# Altium schematic sheet MCH_FPGA_Banks_66_68_HP_FMC.SchDoc: Metlino
size 420 x 297 mm; CheckedBy: P.Kulik,T.Przywozki,W.Ruclo; Author: G.Kasprowicz; CompanyName: WUT ISE; DrawnBy: G.Kasprowicz; Organization: WUT ISE; Address1: PW ISE; Address2: Nowowiejska 15/19 00-665 Warsaw; Address3: gkasprow@gmail.com; DocumentNumber: 5; Revision: 2; SheetNumber: 5; SheetTotal: 29; ModifiedBy: -; CheckedDate: -; Title2: FPGA banks - FMC; DivGrp: WUT ISE; Designer: G.Kasprowicz; ModifiedDate: -; ProjectName: Sensor Box
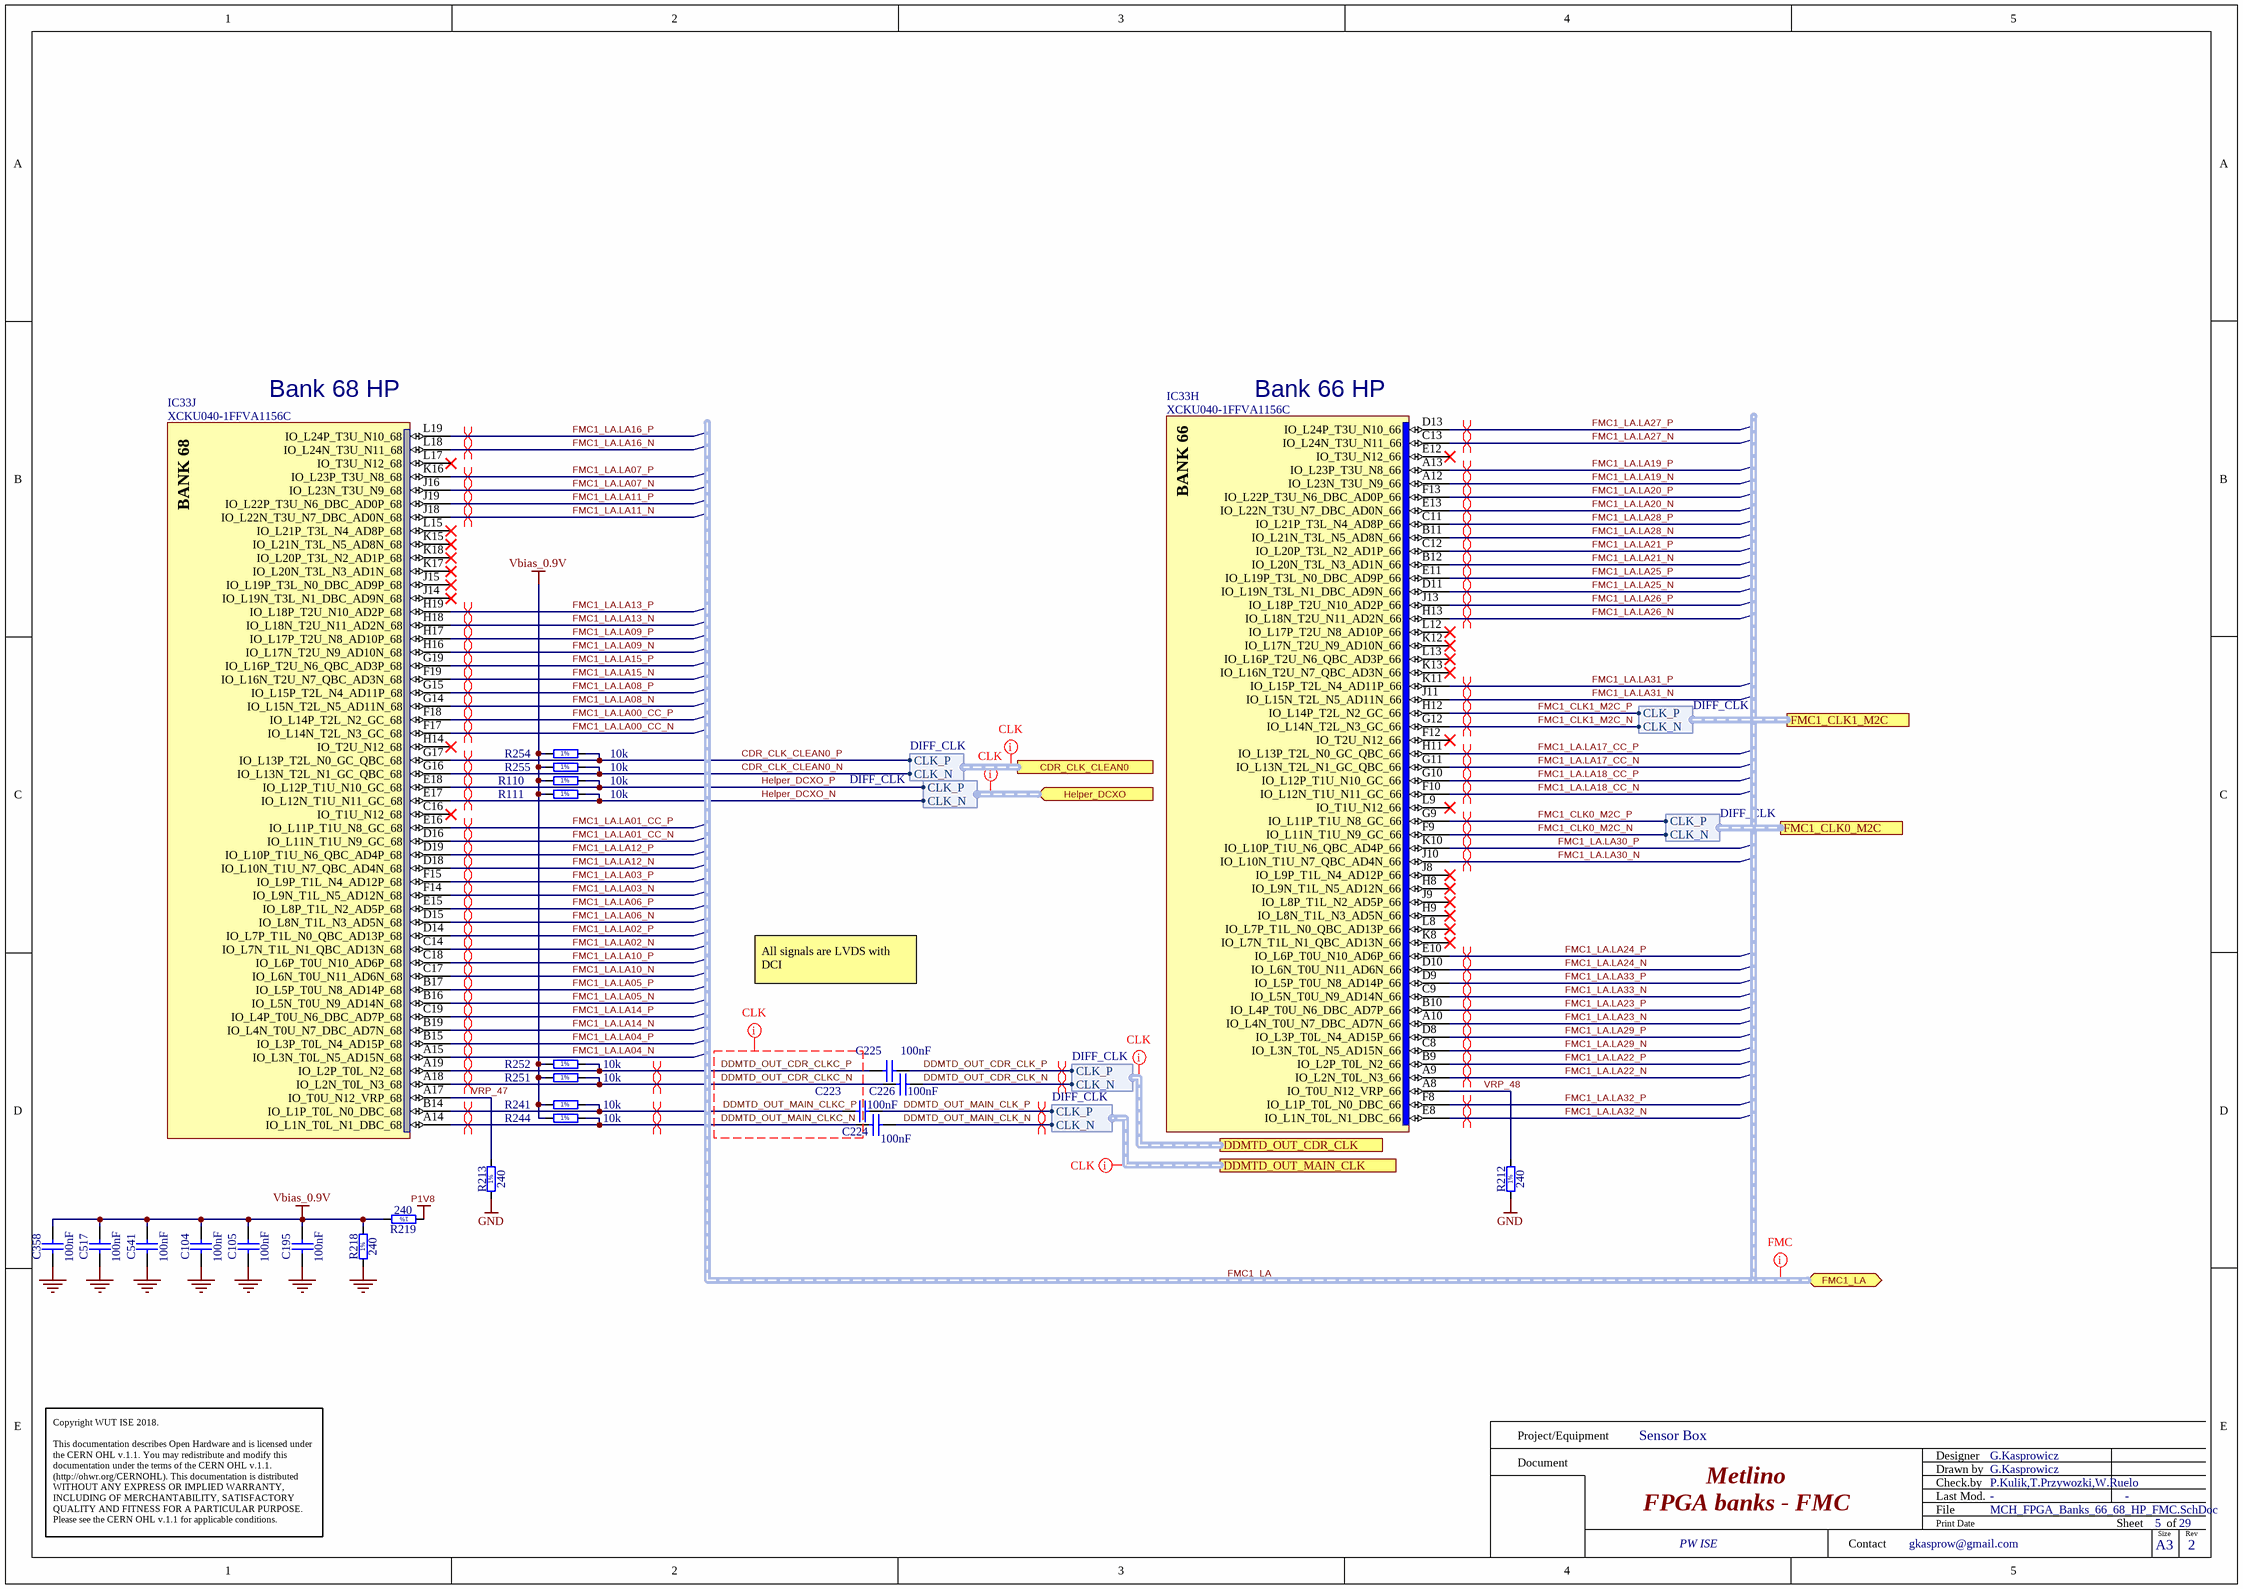
[diagram p0: MCH_FPGA_Banks_66_68_HP_FMC.SchDoc]

## Parts
C104  100nF  [CAPC0603X33N]
C105  100nF  [CAPC0603X33N]
C195  100nF  [CAPC0603X33N]
C223  100nF  [CAPC0603X33N]
C224  100nF  [CAPC0603X33N]
C225  100nF  [CAPC0603X33N]
C226  100nF  [CAPC0603X33N]
C358  100nF  [CAPC0603X33N]
C517  100nF  [CAPC0603X33N]
C541  100nF  [CAPC0603X33N]
IC33  XCKU040-1FFVA1156C  [BGA1156C100P34X34_3500X3500X350]  (parts H,J of 22)
R110  10k  [RESC1005X40N]
R111  10k  [RESC1005X40N]
R212  240  [RESC1005X40N]
R213  240  [RESC1005X40N]
R218  240  [RESC1005X40N]
R219  240  [RESC1005X40N]
R241  10k  [RESC1005X40N]
R244  10k  [RESC1005X40N]
R251  10k  [RESC1005X40N]
R252  10k  [RESC1005X40N]
R254  10k  [RESC1005X40N]
R255  10k  [RESC1005X40N]

## Ports
CDR_CLK_CLEAN0 (harness DIFF_CLK), DDMTD_OUT_CDR_CLK (harness DIFF_CLK), DDMTD_OUT_MAIN_CLK (harness DIFF_CLK), FMC1_CLK0_M2C (harness DIFF_CLK), FMC1_CLK1_M2C (harness DIFF_CLK), FMC1_LA (bidir, harness FMC_LA), Helper_DCXO (in, harness DIFF_CLK)

## Harnesses
DIFF_CLK: CLK_N, CLK_P

## Nets
GND: C104.2 C105.2 C195.2 C358.2 C517.2 C541.2 R212.1 R213.1 R218.1
P1V8: R219.1
Vbias_0.9V: C104.1 C105.1 C195.1 C358.1 C517.1 C541.1 R110.1 R111.1 R218.2 R219.2 R241.1 R244.1 R251.1 R252.1 R254.1 R255.1
CDR_CLK_CLEAN0_N: IC33.G16(IO_L13N_T2L_N1_GC_QBC_68) R255.2 ; port CDR_CLK_CLEAN0.CLK_N
CDR_CLK_CLEAN0_P: IC33.G17(IO_L13P_T2L_N0_GC_QBC_68) R254.2 ; port CDR_CLK_CLEAN0.CLK_P
DDMTD_OUT_CDR_CLK_N: C226.2 ; port DDMTD_OUT_CDR_CLK.CLK_N
DDMTD_OUT_CDR_CLK_P: C225.2 ; port DDMTD_OUT_CDR_CLK.CLK_P
DDMTD_OUT_CDR_CLKC_N: C226.1 IC33.A18(IO_L2N_T0L_N3_68) R251.2
DDMTD_OUT_CDR_CLKC_P: C225.1 IC33.A19(IO_L2P_T0L_N2_68) R252.2
DDMTD_OUT_MAIN_CLK_N: C224.2 ; port DDMTD_OUT_MAIN_CLK.CLK_N
DDMTD_OUT_MAIN_CLK_P: C223.2 ; port DDMTD_OUT_MAIN_CLK.CLK_P
DDMTD_OUT_MAIN_CLKC_N: C224.1 IC33.A14(IO_L1N_T0L_N1_DBC_68) R244.2
DDMTD_OUT_MAIN_CLKC_P: C223.1 IC33.B14(IO_L1P_T0L_N0_DBC_68) R241.2
FMC1_CLK0_M2C_N: IC33.F9(IO_L11N_T1U_N9_GC_66) ; port FMC1_CLK0_M2C.CLK_N
FMC1_CLK0_M2C_P: IC33.G9(IO_L11P_T1U_N8_GC_66) ; port FMC1_CLK0_M2C.CLK_P
FMC1_CLK1_M2C_N: IC33.G12(IO_L14N_T2L_N3_GC_66) ; port FMC1_CLK1_M2C.CLK_N
FMC1_CLK1_M2C_P: IC33.H12(IO_L14P_T2L_N2_GC_66) ; port FMC1_CLK1_M2C.CLK_P
FMC1_LA.LA00_CC_N: IC33.F17(IO_L14N_T2L_N3_GC_68)
FMC1_LA.LA00_CC_P: IC33.F18(IO_L14P_T2L_N2_GC_68)
FMC1_LA.LA01_CC_N: IC33.D16(IO_L11N_T1U_N9_GC_68)
FMC1_LA.LA01_CC_P: IC33.E16(IO_L11P_T1U_N8_GC_68)
FMC1_LA.LA02_N: IC33.C14(IO_L7N_T1L_N1_QBC_AD13N_68)
FMC1_LA.LA02_P: IC33.D14(IO_L7P_T1L_N0_QBC_AD13P_68)
FMC1_LA.LA03_N: IC33.F14(IO_L9N_T1L_N5_AD12N_68)
FMC1_LA.LA03_P: IC33.F15(IO_L9P_T1L_N4_AD12P_68)
FMC1_LA.LA04_N: IC33.A15(IO_L3N_T0L_N5_AD15N_68)
FMC1_LA.LA04_P: IC33.B15(IO_L3P_T0L_N4_AD15P_68)
FMC1_LA.LA05_N: IC33.B16(IO_L5N_T0U_N9_AD14N_68)
FMC1_LA.LA05_P: IC33.B17(IO_L5P_T0U_N8_AD14P_68)
FMC1_LA.LA06_N: IC33.D15(IO_L8N_T1L_N3_AD5N_68)
FMC1_LA.LA06_P: IC33.E15(IO_L8P_T1L_N2_AD5P_68)
FMC1_LA.LA07_N: IC33.J16(IO_L23N_T3U_N9_68)
FMC1_LA.LA07_P: IC33.K16(IO_L23P_T3U_N8_68)
FMC1_LA.LA08_N: IC33.G14(IO_L15N_T2L_N5_AD11N_68)
FMC1_LA.LA08_P: IC33.G15(IO_L15P_T2L_N4_AD11P_68)
FMC1_LA.LA09_N: IC33.H16(IO_L17N_T2U_N9_AD10N_68)
FMC1_LA.LA09_P: IC33.H17(IO_L17P_T2U_N8_AD10P_68)
FMC1_LA.LA10_N: IC33.C17(IO_L6N_T0U_N11_AD6N_68)
FMC1_LA.LA10_P: IC33.C18(IO_L6P_T0U_N10_AD6P_68)
FMC1_LA.LA11_N: IC33.J18(IO_L22N_T3U_N7_DBC_AD0N_68)
FMC1_LA.LA11_P: IC33.J19(IO_L22P_T3U_N6_DBC_AD0P_68)
FMC1_LA.LA12_N: IC33.D18(IO_L10N_T1U_N7_QBC_AD4N_68)
FMC1_LA.LA12_P: IC33.D19(IO_L10P_T1U_N6_QBC_AD4P_68)
FMC1_LA.LA13_N: IC33.H18(IO_L18N_T2U_N11_AD2N_68)
FMC1_LA.LA13_P: IC33.H19(IO_L18P_T2U_N10_AD2P_68)
FMC1_LA.LA14_N: IC33.B19(IO_L4N_T0U_N7_DBC_AD7N_68)
FMC1_LA.LA14_P: IC33.C19(IO_L4P_T0U_N6_DBC_AD7P_68)
FMC1_LA.LA15_N: IC33.F19(IO_L16N_T2U_N7_QBC_AD3N_68)
FMC1_LA.LA15_P: IC33.G19(IO_L16P_T2U_N6_QBC_AD3P_68)
FMC1_LA.LA16_N: IC33.L18(IO_L24N_T3U_N11_68)
FMC1_LA.LA16_P: IC33.L19(IO_L24P_T3U_N10_68)
FMC1_LA.LA17_CC_N: IC33.G11(IO_L13N_T2L_N1_GC_QBC_66)
FMC1_LA.LA17_CC_P: IC33.H11(IO_L13P_T2L_N0_GC_QBC_66)
FMC1_LA.LA18_CC_N: IC33.F10(IO_L12N_T1U_N11_GC_66)
FMC1_LA.LA18_CC_P: IC33.G10(IO_L12P_T1U_N10_GC_66)
FMC1_LA.LA19_N: IC33.A12(IO_L23N_T3U_N9_66)
FMC1_LA.LA19_P: IC33.A13(IO_L23P_T3U_N8_66)
FMC1_LA.LA20_N: IC33.E13(IO_L22N_T3U_N7_DBC_AD0N_66)
FMC1_LA.LA20_P: IC33.F13(IO_L22P_T3U_N6_DBC_AD0P_66)
FMC1_LA.LA21_N: IC33.B12(IO_L20N_T3L_N3_AD1N_66)
FMC1_LA.LA21_P: IC33.C12(IO_L20P_T3L_N2_AD1P_66)
FMC1_LA.LA22_N: IC33.A9(IO_L2N_T0L_N3_66)
FMC1_LA.LA22_P: IC33.B9(IO_L2P_T0L_N2_66)
FMC1_LA.LA23_N: IC33.A10(IO_L4N_T0U_N7_DBC_AD7N_66)
FMC1_LA.LA23_P: IC33.B10(IO_L4P_T0U_N6_DBC_AD7P_66)
FMC1_LA.LA24_N: IC33.D10(IO_L6N_T0U_N11_AD6N_66)
FMC1_LA.LA24_P: IC33.E10(IO_L6P_T0U_N10_AD6P_66)
FMC1_LA.LA25_N: IC33.D11(IO_L19N_T3L_N1_DBC_AD9N_66)
FMC1_LA.LA25_P: IC33.E11(IO_L19P_T3L_N0_DBC_AD9P_66)
FMC1_LA.LA26_N: IC33.H13(IO_L18N_T2U_N11_AD2N_66)
FMC1_LA.LA26_P: IC33.J13(IO_L18P_T2U_N10_AD2P_66)
FMC1_LA.LA27_N: IC33.C13(IO_L24N_T3U_N11_66)
FMC1_LA.LA27_P: IC33.D13(IO_L24P_T3U_N10_66)
FMC1_LA.LA28_N: IC33.B11(IO_L21N_T3L_N5_AD8N_66)
FMC1_LA.LA28_P: IC33.C11(IO_L21P_T3L_N4_AD8P_66)
FMC1_LA.LA29_N: IC33.C8(IO_L3N_T0L_N5_AD15N_66)
FMC1_LA.LA29_P: IC33.D8(IO_L3P_T0L_N4_AD15P_66)
FMC1_LA.LA30_N: IC33.J10(IO_L10N_T1U_N7_QBC_AD4N_66)
FMC1_LA.LA30_P: IC33.K10(IO_L10P_T1U_N6_QBC_AD4P_66)
FMC1_LA.LA31_N: IC33.J11(IO_L15N_T2L_N5_AD11N_66)
FMC1_LA.LA31_P: IC33.K11(IO_L15P_T2L_N4_AD11P_66)
FMC1_LA.LA32_N: IC33.E8(IO_L1N_T0L_N1_DBC_66)
FMC1_LA.LA32_P: IC33.F8(IO_L1P_T0L_N0_DBC_66)
FMC1_LA.LA33_N: IC33.C9(IO_L5N_T0U_N9_AD14N_66)
FMC1_LA.LA33_P: IC33.D9(IO_L5P_T0U_N8_AD14P_66)
Helper_DCXO_N: IC33.E17(IO_L12N_T1U_N11_GC_68) R111.2 ; port Helper_DCXO.CLK_N
Helper_DCXO_P: IC33.E18(IO_L12P_T1U_N10_GC_68) R110.2 ; port Helper_DCXO.CLK_P
VRP_47: IC33.A17(IO_T0U_N12_VRP_68) R213.2
VRP_48: IC33.A8(IO_T0U_N12_VRP_66) R212.2

Not connected (* = marked no-connect by the designer): IC33 C16(IO_T1U_N12_68)* E12(IO_T3U_N12_66)* F12(IO_T2U_N12_66)* H8(IO_L9N_T1L_N5_AD12N_66)* H9(IO_L8N_T1L_N3_AD5N_66)* H14(IO_T2U_N12_68)* J8(IO_L9P_T1L_N4_AD12P_66)* J9(IO_L8P_T1L_N2_AD5P_66)* J14(IO_L19N_T3L_N1_DBC_AD9N_68)* J15(IO_L19P_T3L_N0_DBC_AD9P_68)* K8(IO_L7N_T1L_N1_QBC_AD13N_66)* K12(IO_L17N_T2U_N9_AD10N_66)* K13(IO_L16N_T2U_N7_QBC_AD3N_66)* K15(IO_L21N_T3L_N5_AD8N_68)* K17(IO_L20N_T3L_N3_AD1N_68)* K18(IO_L20P_T3L_N2_AD1P_68)* L8(IO_L7P_T1L_N0_QBC_AD13P_66)* L9(IO_T1U_N12_66)* L12(IO_L17P_T2U_N8_AD10P_66)* L13(IO_L16P_T2U_N6_QBC_AD3P_66)* L15(IO_L21P_T3L_N4_AD8P_68)* L17(IO_T3U_N12_68)*

## Buses and harness runs
harness FMC1_LA = port FMC1_LA

## Layout directives
net class CLK: (no net found under the mark), DDMTD_OUT_CDR_CLKC_N, DDMTD_OUT_CDR_CLKC_P, DDMTD_OUT_MAIN_CLKC_N, DDMTD_OUT_MAIN_CLKC_P
differential pair: CDR_CLK_CLEAN0_N, CDR_CLK_CLEAN0_P, DDMTD_OUT_CDR_CLK_N, DDMTD_OUT_CDR_CLK_P, DDMTD_OUT_CDR_CLKC_N, DDMTD_OUT_CDR_CLKC_P, DDMTD_OUT_MAIN_CLK_N, DDMTD_OUT_MAIN_CLK_P, DDMTD_OUT_MAIN_CLKC_N, DDMTD_OUT_MAIN_CLKC_P, FMC1_CLK0_M2C_N, FMC1_CLK0_M2C_P, FMC1_CLK1_M2C_N, FMC1_CLK1_M2C_P, FMC1_LA.LA00_CC_N, FMC1_LA.LA00_CC_P, FMC1_LA.LA01_CC_N, FMC1_LA.LA01_CC_P, FMC1_LA.LA02_N, FMC1_LA.LA02_P, FMC1_LA.LA03_N, FMC1_LA.LA03_P, FMC1_LA.LA04_N, FMC1_LA.LA04_P, FMC1_LA.LA05_N, FMC1_LA.LA05_P, FMC1_LA.LA06_N, FMC1_LA.LA06_P, FMC1_LA.LA07_N, FMC1_LA.LA07_P, FMC1_LA.LA08_N, FMC1_LA.LA08_P, FMC1_LA.LA09_N, FMC1_LA.LA09_P, FMC1_LA.LA10_N, FMC1_LA.LA10_P, FMC1_LA.LA11_N, FMC1_LA.LA11_P, FMC1_LA.LA12_N, FMC1_LA.LA12_P, FMC1_LA.LA13_N, FMC1_LA.LA13_P, FMC1_LA.LA14_N, FMC1_LA.LA14_P, FMC1_LA.LA15_N, FMC1_LA.LA15_P, FMC1_LA.LA16_N, FMC1_LA.LA16_P, FMC1_LA.LA17_CC_N, FMC1_LA.LA17_CC_P, FMC1_LA.LA18_CC_N, FMC1_LA.LA18_CC_P, FMC1_LA.LA19_N, FMC1_LA.LA19_P, FMC1_LA.LA20_N, FMC1_LA.LA20_P, FMC1_LA.LA21_N, FMC1_LA.LA21_P, FMC1_LA.LA22_N, FMC1_LA.LA22_P, FMC1_LA.LA23_N, FMC1_LA.LA23_P, FMC1_LA.LA24_N, FMC1_LA.LA24_P, FMC1_LA.LA25_N, FMC1_LA.LA25_P, FMC1_LA.LA26_N, FMC1_LA.LA26_P, FMC1_LA.LA27_N, FMC1_LA.LA27_P, FMC1_LA.LA28_N, FMC1_LA.LA28_P, FMC1_LA.LA29_N, FMC1_LA.LA29_P, FMC1_LA.LA30_N, FMC1_LA.LA30_P, FMC1_LA.LA31_N, FMC1_LA.LA31_P, FMC1_LA.LA32_N, FMC1_LA.LA32_P, FMC1_LA.LA33_N, FMC1_LA.LA33_P, Helper_DCXO_N, Helper_DCXO_P
net class LVDS_FMC: (no net found under the mark)

## Notes on the sheet
- (near IC33) Bank 68 HP
- (near IC33) Bank 66 HP
- All signals are LVDS with DCI
- Project/Equipment
- Document
- Designer
- Drawn by
- Check.by
- Copyright WUT ISE 2018.
  This documentation describes Open Hardware and is licensed under the CERN OHL v.1.1. You may redistribute and modify this documentation under the terms of the CERN OHL v.1.1. (http://ohwr.org/CERNOHL). This documentation is distributed WITHOUT ANY EXPRESS OR IMPLIED WARRANTY, INCLUDING OF MERCHANTABILITY, SATISFACTORY QUALITY AND FITNESS FOR A PARTICULAR PURPOSE. Please see the CERN OHL v.1.1 for applicable conditions.
- Contact
- File
- Last Mod.
- Print Date
- Sheet
- Size
- A3
- of
- Rev
- (in symbol R0402_10K_1%_0.0625W_100PPM) 1%
- (in symbol R0402_240R_1%_0.0625W_100PPM) 1%
- (in symbol XCKU040-1FFVA1156C, part H) BANK 66
- (in symbol XCKU040-1FFVA1156C, part J) BANK 68

## Library data of the parts
C104 C105 C195 C223-C226 C358 C517 C541 = CC0201_100NF_6.3V_10%_X5R: Non-polarised capacitor; Manufacturer: GENERIC; Part Description: SMD Multilayer Chip Ceramic Capacitor; Manufacturer1 Part Number: 02016D104KAT2A; Tolerance: ±10%; Voltage: 6.3V; TC: X5R; Manufacturer Part Number: CC0201_100NF_6.3V_10%_X5R; Part Number: CC0201_100NF_6.3V_10%_X5R; Value: 100nF; Component Kind: Standard; Component Type: Standard; Pin Count: 2; Status: Not Recommended; Case: 0201; Mounted: Yes; Socket: No; SMD: Yes; Sense: No; Manufacturer1 Example: AVX; Manufacturer1 ComponentHeight: 0.33mm; HelpURL: \\cern.ch\dfs\Applications\Altium\Datasheets\CC0201_X5R_AVX.pdf; Author: CERN DEM JLC; CreateDate: 03.12.2007; LatestRevisionDate: 03.12.2007
IC33 = XCKU040-1FFVA1156C: Kintex UltraScale FPGA, 520 I/O, 530K Cells, 1156-Ball BGA, Speed Grade 1, Commercial Grade; Manufacturer: XILINX; Part Description: Kintex UltraScale, 40 DLL I/O, 416 HP I/O, 104 HR I/O, 1156-Pin BGA, Speed Grade 1, Commercial Grade; PressFit: No; Bonding: No; PackageDescription: BGA, 1.00mm Pitch, Square; 1156 Pin, 34 Columns X 34 Rows, Body 35.00mm X 35.00mm X 3.50mm H, IPC Medium Density; Part Number: XCKU040-1FFVA1156C; Component Kind: Standard; Component Type: Standard; Device: XCKU040-1FFVA1156C; Manufacturer Part Number: XCKU040-1FFVA1156C; Pin Count: 1156; Case: BGA1156; Mounted: Yes; Socket: No; SMD: Yes; Sense: No; ComponentHeight: 3.5mm; HelpURL: \\cern.ch\dfs\Applications\Altium\Datasheets\XCKU040-1FFVA1156C.pdf; ComponentLink1URL: \\cern.ch\dfs\Applications\Altium\Datasheets\XCKU040-1FFVA1156C_Package-Pinout.pdf; ComponentLink1Description: Package/Pinout; Author: CERN DEM CA; CreateDate: 16.08.2016; LatestRevisionDate: 16.08.2016
R110 R111 R241 R244 R251 R252 R254 R255 = R0402_10K_1%_0.0625W_100PPM: Resistor - 1%; Manufacturer: GENERIC; Part Description: General Purpose Thick Film Chip Resistor; Manufacturer1 Part Number: 232270671003L; TC: ±100ppm/°C; PressFit: No; Manufacturer Part Number: R0402_10K_1%_0.0625W_100PPM; Part Number: R0402_10K_1%_0.0625W_100PPM; Tolerance: ±1%; Value: 10k; Component Kind: Standard; Component Type: Standard; Pin Count: 2; Status: Not Recommended; Power: 0.0625W; Case: 0402; Mounted: Yes; Sense: No; Socket: No; SMD: Yes; Manufacturer1 Example: YAGEO PHYCOMP; Manufacturer1 ComponentHeight: 0.4mm; HelpURL: \\cern.ch\dfs\Applications\Altium\Datasheets\R0402_Phycomp_RC0402.pdf; Author: CERN DEM JLC; CreateDate: 03.12.2007; LatestRevisionDate: 17.10.2012
R212 R213 R218 R219 = R0402_240R_1%_0.0625W_100PPM: Resistor - 1%; Manufacturer: GENERIC; Part Description: General Purpose Thick Film Chip Resistor; Manufacturer1 Part Number: 232270672401L; TC: ±100ppm/°C; PressFit: No; Manufacturer Part Number: R0402_240R_1%_0.0625W_100PPM; Part Number: R0402_240R_1%_0.0625W_100PPM; Tolerance: ±1%; Value: 240; Component Kind: Standard; Component Type: Standard; Pin Count: 2; Status: Not Recommended; Power: 0.0625W; Case: 0402; Mounted: Yes; Sense: No; Socket: No; SMD: Yes; Manufacturer1 Example: YAGEO PHYCOMP; Manufacturer1 ComponentHeight: 0.4mm; HelpURL: \\cern.ch\dfs\Applications\Altium\Datasheets\R0402_Phycomp_RC0402.pdf; Author: CERN DEM JLC; CreateDate: 03.12.2007; LatestRevisionDate: 17.10.2012